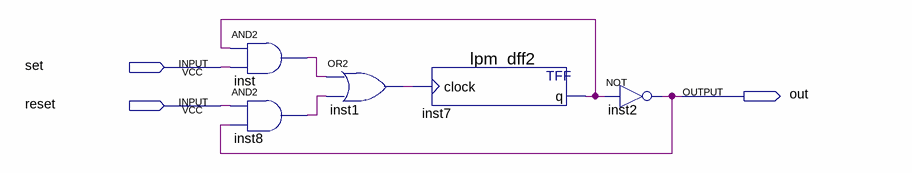
[diagram p0: schematic sheet]
// Quartus schematic RS-trigger.bdf as structural Verilog: 5 symbols, 3 pins
module \RS-trigger  (
  input  set,
  input  reset,
  output out
);

  wire inst1_out, inst7_q, inst8_out, inst_out;

  and inst (inst_out, inst7_q, set);
  and inst8 (inst8_out, reset, out);
  or inst1 (inst1_out, inst_out, inst8_out);
  lpm_dff2 inst7 (.clock(inst1_out), .q(inst7_q));
  not inst2 (out, inst7_q);
endmodule
